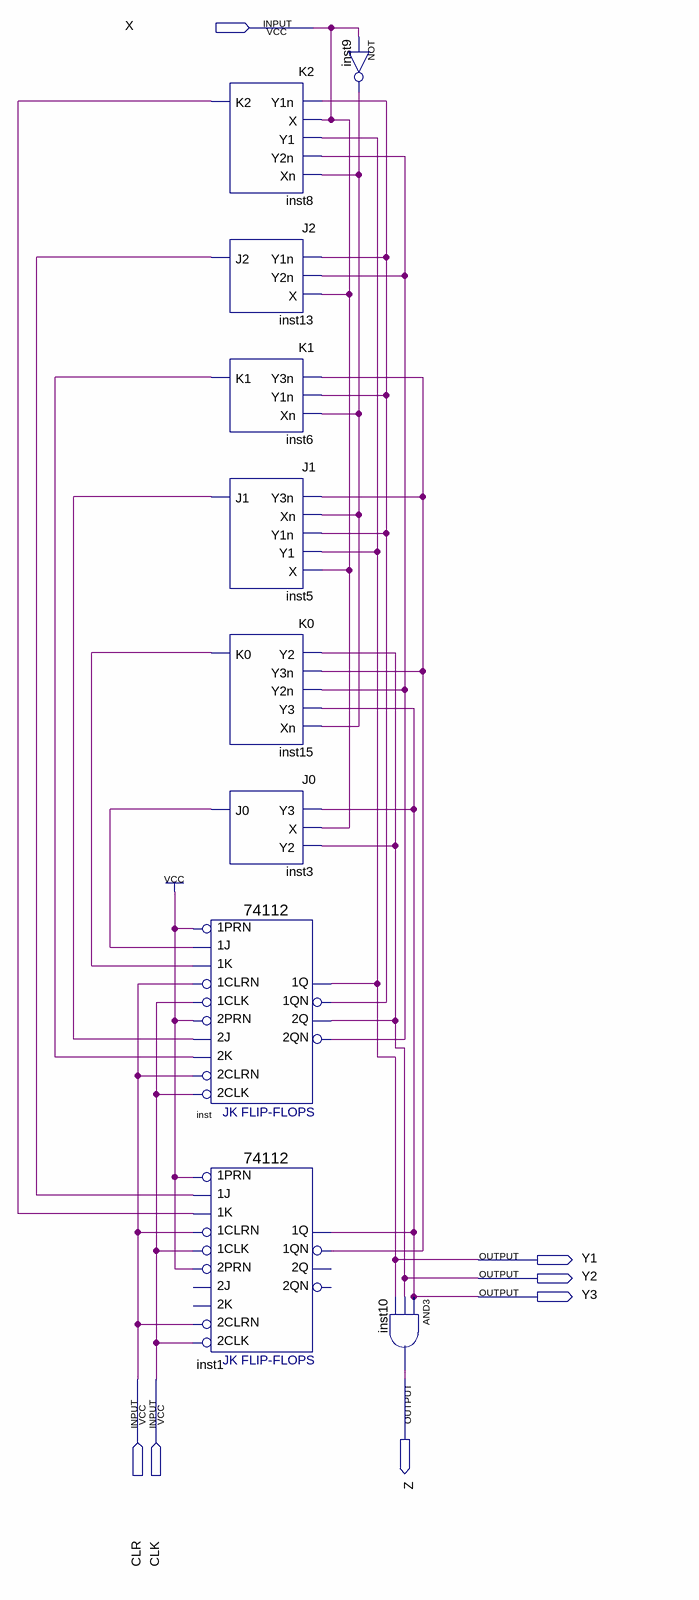
[diagram p0: schematic sheet]
// Quartus schematic Lock.bdf as structural Verilog: 10 symbols, 7 pins
module Lock (
  input  X,
  input  CLR,
  input  CLK,
  output Y1,
  output Y2,
  output Y3,
  output Z
);

  wire inst1_1qn, inst3_j0, inst5_j1, inst6_k1, inst8_k2, inst9_out, inst13_j2, inst15_k0, inst_1qn, inst_2qn;

  K2 inst8 (.Y1n(inst_1qn), .X(X), .Y1(Y1), .Y2n(inst_2qn), .Xn(inst9_out), .K2(inst8_k2));
  J2 inst13 (.Y1n(inst_1qn), .Y2n(inst_2qn), .X(X), .J2(inst13_j2));
  K1 inst6 (.Y3n(inst1_1qn), .Y1n(inst_1qn), .Xn(inst9_out), .K1(inst6_k1));
  J1 inst5 (.Y3n(inst1_1qn), .Xn(inst9_out), .Y1n(inst_1qn), .Y1(Y1), .X(X), .J1(inst5_j1));
  K0 inst15 (.Y2(Y2), .Y3n(inst1_1qn), .Y2n(inst_2qn), .Y3(Y3), .Xn(inst9_out), .K0(inst15_k0));
  J0 inst3 (.Y3(Y3), .X(X), .Y2(Y2), .J0(inst3_j0));
  \74112  inst (
    .\1K (inst15_k0), .\1J (inst3_j0), .\1PRN (1'b1), .\1CLK (CLK), .\1CLRN (CLR), .\2K (inst6_k1),
    .\2J (inst5_j1), .\2PRN (1'b1), .\2CLK (CLK), .\2CLRN (CLR), .\1QN (inst_1qn), .\2Q (Y2), .\1Q (Y1),
    .\2QN (inst_2qn));
  \74112  inst1 (
    .\1K (inst8_k2), .\1J (inst13_j2), .\1PRN (1'b1), .\1CLK (CLK), .\1CLRN (CLR), .\2PRN (1'b1),
    .\2CLK (CLK), .\2CLRN (CLR), .\1QN (inst1_1qn), .\1Q (Y3));  // open: 2K, 2J, 2Q, 2QN
  not inst9 (inst9_out, X);
  and inst10 (Z, Y3, Y2, Y1);
endmodule
